# Altium schematic sheet PeltierControl.SchDoc
size A4
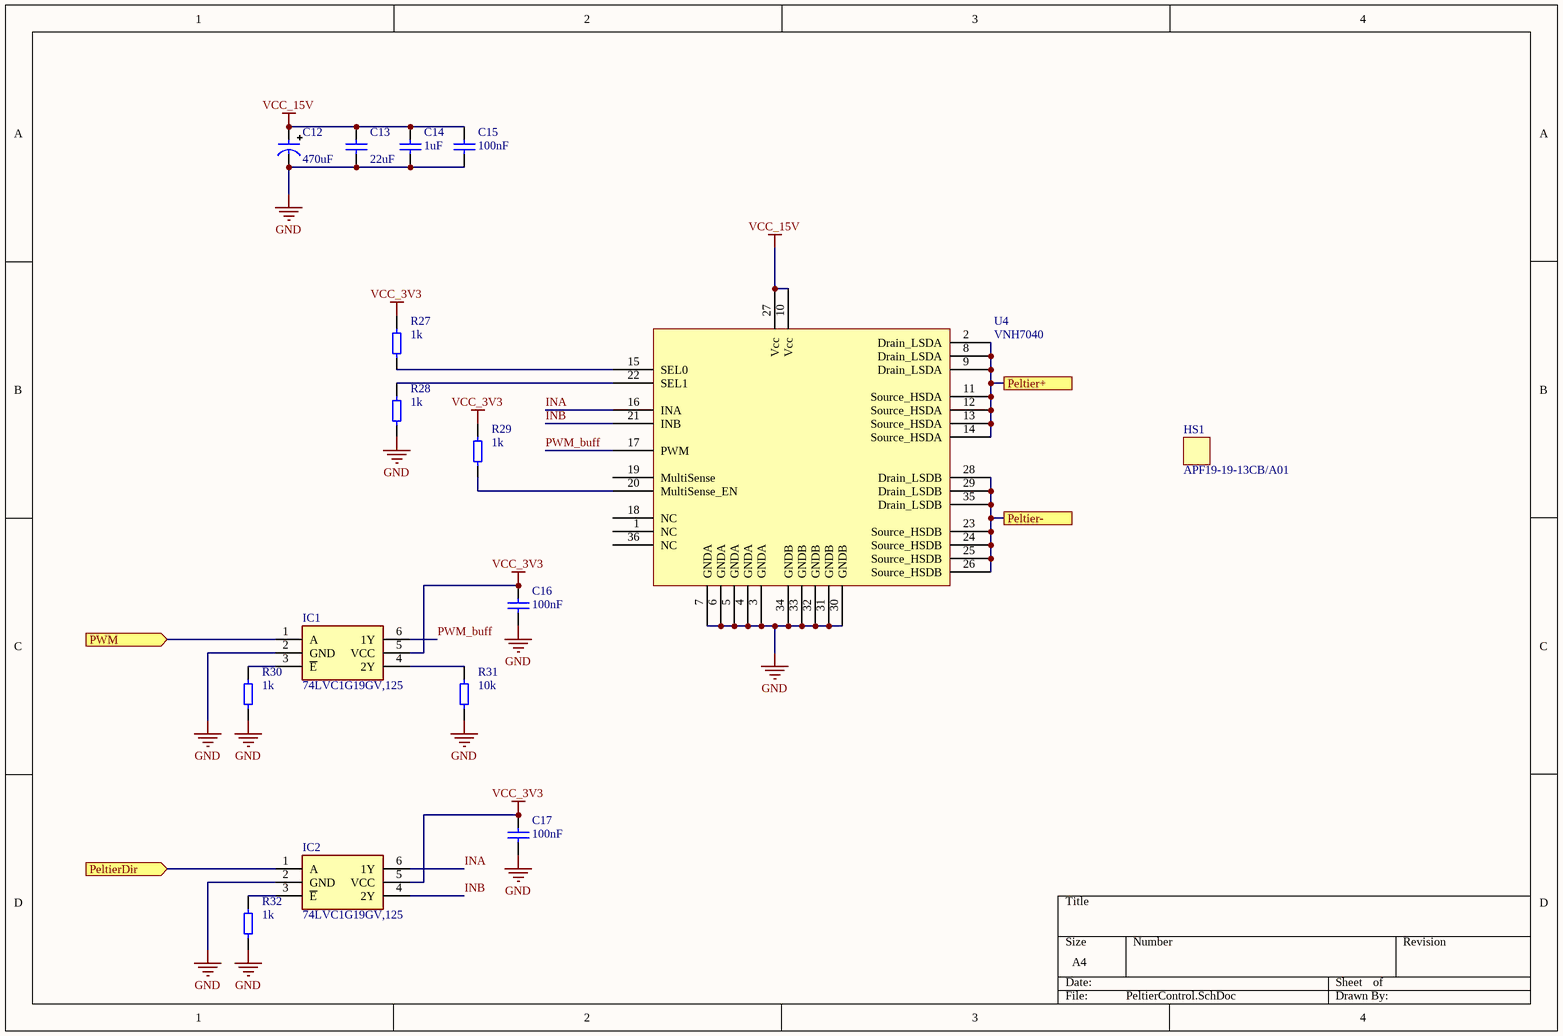
[diagram p0: PeltierControl.SchDoc]

## Parts
C12  470uF  [EEV-FK1H471M]
C13  22uF  [0805-Capacitor]
C14  1uF  [0603-Capacitor]
C15  100nF  [0603-Capacitor]
C16  100nF  [0603-Capacitor]
C17  100nF  [0603-Capacitor]
HS1  APF19-19-13CB/A01  [APF19-19-13CB/A01]
IC1  74LVC1G19GV,125  [SOT95P275X110-6N]
IC2  74LVC1G19GV,125  [SOT95P275X110-6N]
R27  1k  [0603-Resistor]
R28  1k  [0603-Resistor]
R29  1k  [0603-Resistor]
R30  1k  [0603-Resistor]
R31  10k  [0603-Resistor]
R32  1k  [0603-Resistor]
U4  VNH7040  [PowerSSO-36]

## Ports
Peltier+, Peltier-, PeltierDir (in), PWM (in)

## Nets
GND: C12.2 C13.2 C14.2 C15.2 C16.2 C17.2 IC1.2(GND) IC2.2(GND) R28.1 R30.1 R31.1 R32.1 U4.3(GNDA) U4.4(GNDA) U4.5(GNDA) U4.6(GNDA) U4.7(GNDA) U4.30(GNDB) U4.31(GNDB) U4.32(GNDB) U4.33(GNDB) U4.34(GNDB)
VCC_3V3: C16.1 C17.1 IC1.5(VCC) IC2.5(VCC) R27.2 R29.2
VCC_15V: C12.1 C13.1 C14.1 C15.1 U4.10(Vcc) U4.27(Vcc)
INA: IC2.6(1Y) U4.16(INA)
INB: IC2.4(2Y) U4.21(INB)
Peltier+: U4.2(Drain_LSDA) U4.8(Drain_LSDA) U4.9(Drain_LSDA) U4.11(Source_HSDA) U4.12(Source_HSDA) U4.13(Source_HSDA) U4.14(Source_HSDA) ; port Peltier+
Peltier-: U4.23(Source_HSDB) U4.24(Source_HSDB) U4.25(Source_HSDB) U4.26(Source_HSDB) U4.28(Drain_LSDB) U4.29(Drain_LSDB) U4.35(Drain_LSDB) ; port Peltier-
PeltierDir: IC2.1(A) ; port PeltierDir
PWM: IC1.1(A) ; port PWM
PWM_buff: IC1.6(1Y) U4.17(PWM)
NetIC1_3: IC1.3(~{E}) R30.2
NetIC1_4: IC1.4(2Y) R31.2
NetIC2_3: IC2.3(~{E}) R32.2
NetR27_1: R27.1 U4.15(SEL0)
NetR28_2: R28.2 U4.22(SEL1)
NetR29_1: R29.1 U4.20(MultiSense_EN)

Not connected (* = marked no-connect by the designer): U4 1(NC) 18(NC) 19(MultiSense) 36(NC)

## Library data of the parts
C12 = Panasonic_FK_PCR_6.3_Capacitor: Aluminum Electrolytic Capacitors; Voltage Rating: 50V; Tolerance: 20%; HelpURL: http://www.farnell.com/datasheets/2002520.pdf?_ga=2.2422448.16562209.1508850292-516227586.1495631175; Supplier 1: Farnell; Package: PCR-6.3-7.7; Manufacturer: Panasonic; Supplier Part Number 1: *; ManufacturerNr: EEV-FK1H471M; Pin Count: 2; Value: 470uF; Dielectric: Aluminum Electrolytic; Series: FK; Part Number: Panasonic_FK_PCR_6.3_Capacitor
C13 = C0805: Capacitor; Part Number: C0805; Pin Count: 2; Manufacturer: *; Package: 0805; ManufacturerNr: *; Value: 22uF; Voltage Rating: *; Dielectric: *
C14-C17 = C0603: Capacitor; Part Number: C0603; Pin Count: 2; Manufacturer: *; Package: 0603; ManufacturerNr: *; Voltage Rating: *; Dielectric: *
  C14: Value: 1uF
  C15-C17: Value: 100nF
HS1 = heatsink: Manufacturer: CTS Electronic Components; Manufacturer Nr: APF19-19-13CB/A01
IC1 IC2 = 74LVC1G19GV,125: Integrated Circuit; Manufacturer_Name: Nexperia; Datasheet Link: https://assets.nexperia.com/documents/data-sheet/74LVC1G19.pdf; Height: 1.1mm; Manufacturer_Part_Number: 74LVC1G19GV,125
R27-R32 = R0603: Resistor; Part Number: R0603; Pin Count: 2; Manufacturer: *; Package: 0603; ManufacturerNr: *
  R27-R30 R32: Value: 1k
  R31: Value: 10k
U4 = VNH7040: Engine driver/ H bridge; Manufacturer: STMicroelectronics; Manufacturer Nr: VNH7040AYTR